# EAGLE design ottSchematic (EAGLE 9.6.2)

## Sheet 1 of 2
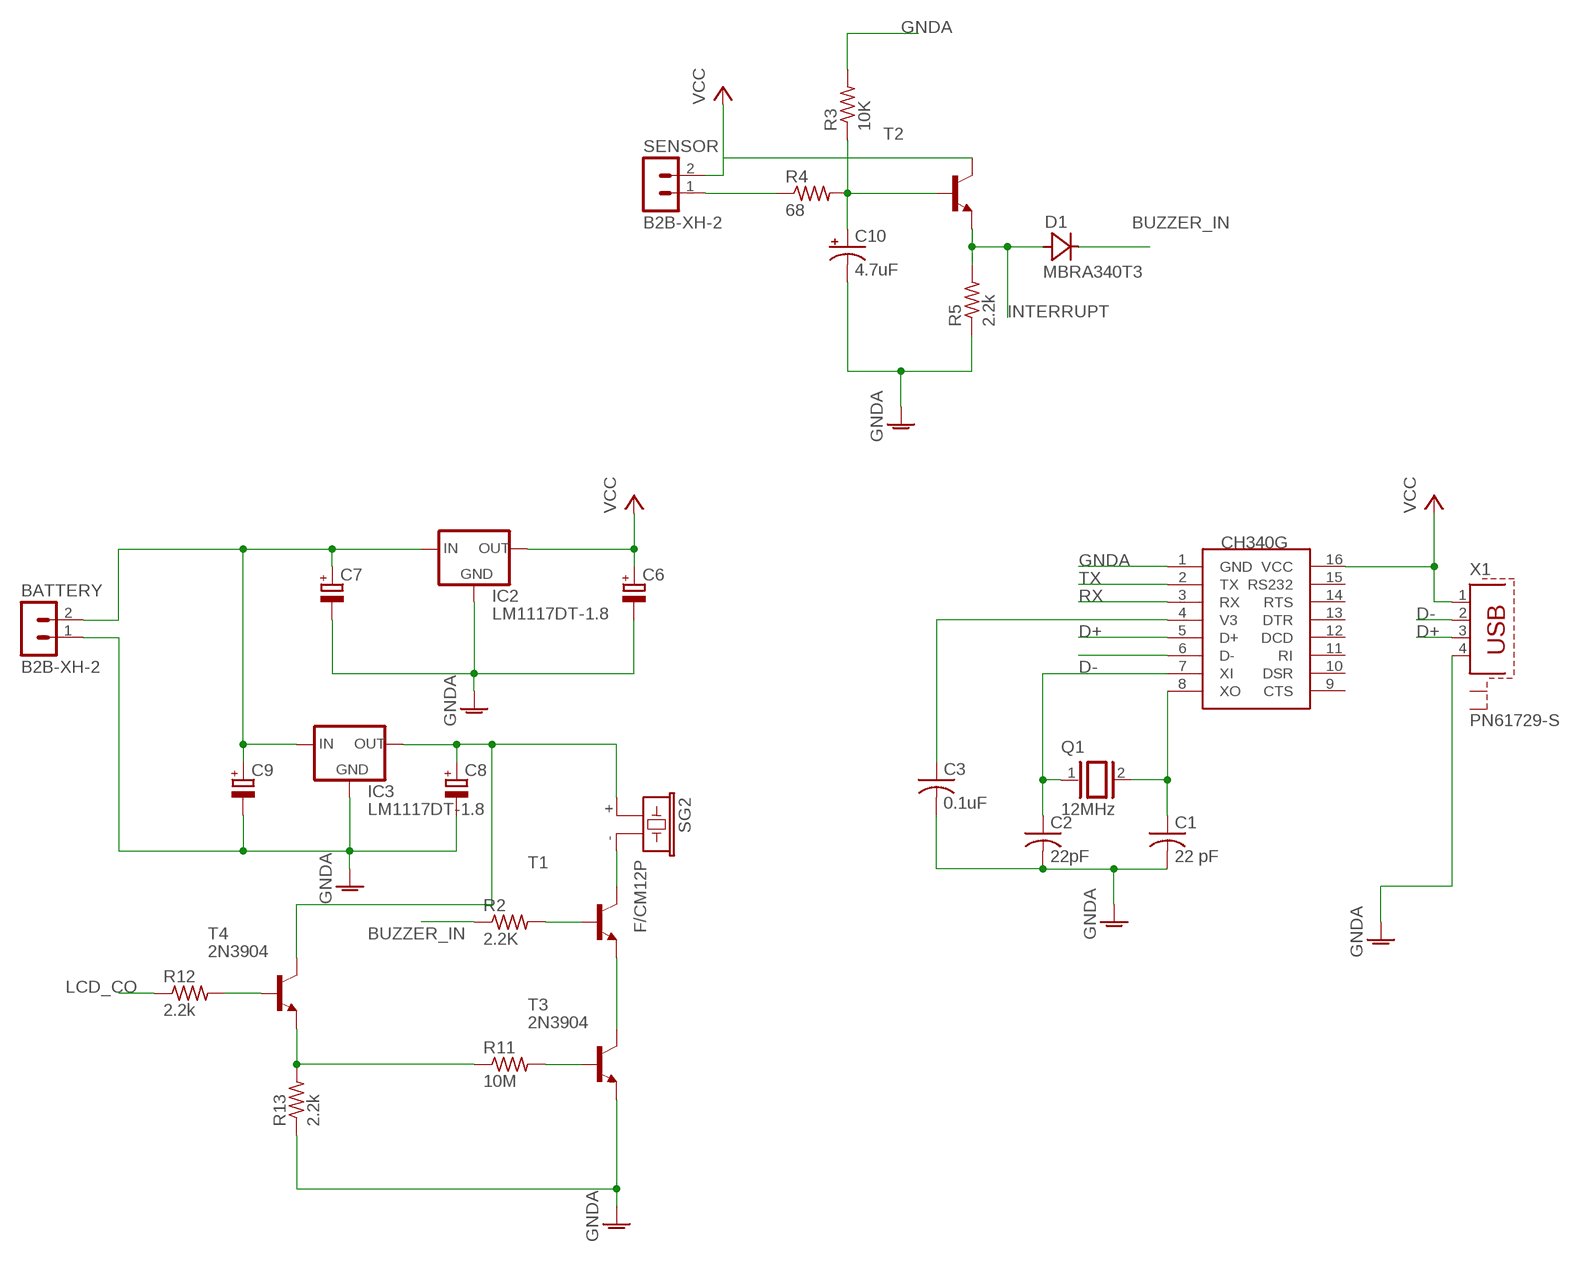
[diagram p0: schematic, sheet 1]

### Parts
BATTERY  B2B-XH-2  [B2B-XH-A]
C1  22 pF  C-USC0603K  [C0603K]
C2  22pF  C-USC0603K  [C0603K]
C3  0.1uF  C-USC1206K  [C1206K]
C6  CPOL-EU175TMP-0808  [175TMP-0808]
C7  CPOL-EU175TMP-0808  [175TMP-0808]
C8  CPOL-EU175TMP-0808  [175TMP-0808]
C9  CPOL-EU175TMP-0808  [175TMP-0808]
C10  4.7uF  CPOL-USE5-8.5  [E5-8,5]
D1  MBRA340T3  [SMA]
IC2  LM1117DT-1.8  [TO252]
IC3  LM1117DT-1.8  [TO252]
Q1  12MHz  XTAL/S  [QS]
R2  2.2K  R-US_R0805  [R0805]
R3  10K  R-US_R0805  [R0805]
R4  68  R-US_0309/12  [0309/12]
R5  2.2k  R-US_R0805  [R0805]
R11  10M  R-US_R0805  [R0805]
R12  2.2k  R-US_R0805  [R0805]
R13  2.2k  R-US_R0805  [R0805]
SENSOR  B2B-XH-2  [B2B-XH-A]
SG2  F/CM12P  [F/CM12P]
T1  MMBT3904LT1-NPN-SOT23-BEC  [SOT23-BEC]
T2  MMBT3904LT1-NPN-SOT23-BEC  [SOT23-BEC]
T3  2N3904  [TO92]
T4  2N3904  [TO92]
U$1  CH340G  [SOIC16]
X1  PN61729-S  [PN61729-S]

### Nets
BUZZER_IN: D1.C R2.1 ; also sheet 2
D+: U$1.5(D+) X1.3
D-: U$1.6(D-) X1.2
GNDA: BATTERY.1 C1.2 C2.2 C3.2 C6.- C7.- C8.- C9.- C10.- IC2.1(GND) IC3.1(GND) R3.2 R5.1 R13.1 T3.3(E) U$1.1(GND) X1.4 ; also sheet 2
INTERRUPT: D1.A R5.2 T2.E ; also sheet 2
LCD_CO: R12.1 ; also sheet 2
N$1: C1.1 Q1.2 U$1.8(XO)
N$2: C2.1 Q1.1 U$1.7(XI)
N$3: C3.1 U$1.4(V3)
N$7: SG2.- T1.C
N$8: C10.+ R3.1 R4.2 T2.B
N$9: BATTERY.2 C7.+ C9.+ IC2.2(IN) IC3.2(IN)
N$10: C8.+ IC3.3(OUT) SG2.+ T4.1(C)
N$12: R4.1 SENSOR.1
N$13: T1.E T3.1(C)
N$14: R2.2 T1.B
N$15: R11.2 T3.2(B)
N$16: R11.1 R13.2 T4.3(E)
N$19: R12.2 T4.2(B)
RX: U$1.3(RX) ; also sheet 2
TX: U$1.2(TX) ; also sheet 2
VCC: C6.+ IC2.3(OUT) SENSOR.2 T2.C U$1.16(VCC) X1.1 ; also sheet 2
Unconnected: U$1.9(CTS) U$1.10(DSR) U$1.11(RI) U$1.12(DCD) U$1.13(DTR) U$1.14(RTS) U$1.15(RS232) X1.S1 X1.S2

## Sheet 2 of 2
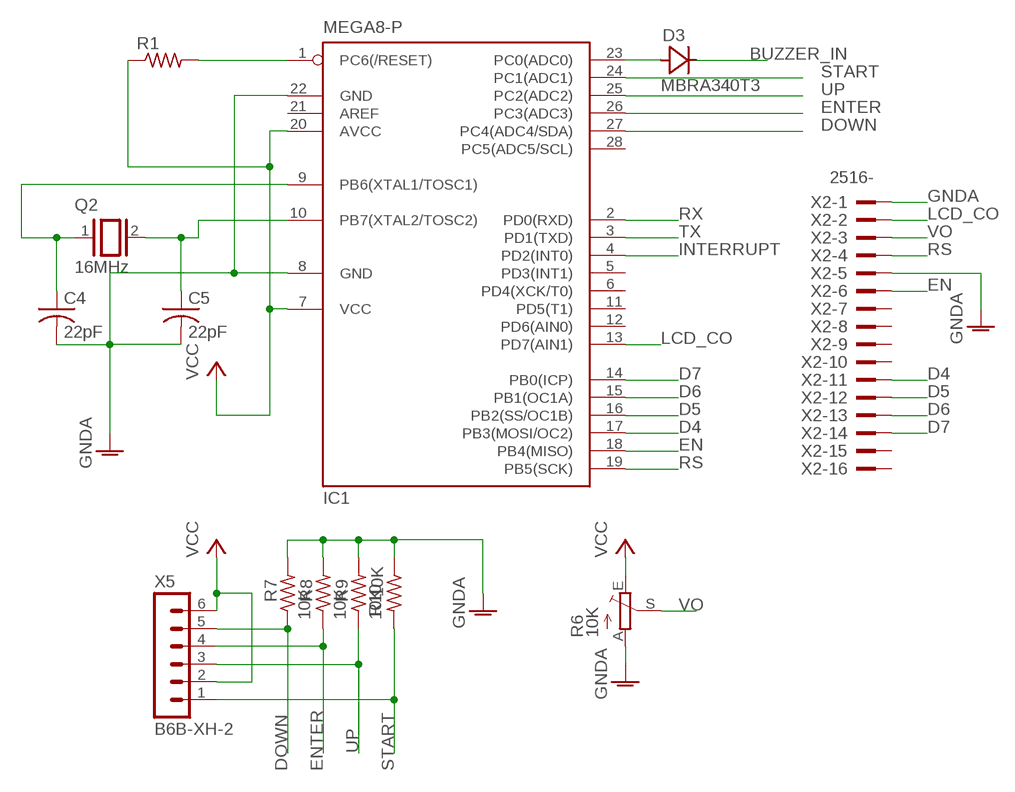
[diagram p1: schematic, sheet 2]

### Parts
C4  22pF  C-USC0805  [C0805]
C5  22pF  C-USC0805  [C0805]
D3  MBRA340T3  [SMA]
IC1  MEGA8-P  [DIL28-3]
Q2  16MHz  XTAL/S  [QS]
R1  R-US_R0805  [R0805]
R6  10K  TRIM_EU-B64Y  [B64Y]
R7  10K  R-US_R0805  [R0805]
R8  10K  R-US_R0805  [R0805]
R9  10K  R-US_R0805  [R0805]
R10  10K  R-US_R0805  [R0805]
X2  2516-  [PAK100/2500-16]
X5  B6B-XH-2  [B6B-XH-A]

### Nets
BUZZER_IN: D3.C ; also sheet 1
D4: IC1.17(PB3(MOSI/OC2)) X2.11
D5: IC1.16(PB2(SS/OC1B)) X2.12
D6: IC1.15(PB1(OC1A)) X2.13
D7: IC1.14(PB0(ICP)) X2.14
DOWN: IC1.27(PC4(ADC4/SDA)) R7.1 X5.5
EN: IC1.18(PB4(MISO)) X2.6
ENTER: IC1.26(PC3(ADC3)) R8.1 X5.4
GNDA: C4.2 C5.2 IC1.8(GND) IC1.22(GND) R6.A R7.2 R8.2 R9.2 R10.1 X2.1 X2.5 ; also sheet 1
INTERRUPT: IC1.4(PD2(INT0)) ; also sheet 1
LCD_CO: IC1.13(PD7(AIN1)) X2.2 ; also sheet 1
N$4: C4.1 IC1.9(PB6(XTAL1/TOSC1)) Q2.1
N$5: C5.1 IC1.10(PB7(XTAL2/TOSC2)) Q2.2
N$6: IC1.1(PC6(/RESET)) R1.2
N$11: D3.A IC1.23(PC0(ADC0))
RS: IC1.19(PB5(SCK)) X2.4
RX: IC1.2(PD0(RXD)) ; also sheet 1
START: IC1.24(PC1(ADC1)) R10.2 X5.1
TX: IC1.3(PD1(TXD)) ; also sheet 1
UP: IC1.25(PC2(ADC2)) R9.1 X5.3
VCC: IC1.7(VCC) IC1.20(AVCC) R1.1 R6.E X5.2 X5.6 ; also sheet 1
VO: R6.S X2.3
Unconnected: IC1.5(PD3(INT1)) IC1.6(PD4(XCK/T0)) IC1.11(PD5(T1)) IC1.12(PD6(AIN0)) IC1.21(AREF) IC1.28(PC5(ADC5/SCL)) X2.7 X2.8 X2.9 X2.10 X2.15 X2.16

## Library data of the parts
BATTERY SENSOR = con-JST XH:B2B-XH: JST XH series header 2.50mm pitch disconnectable crimp style connectors, vertical (side entry type), 2 pins
C1-C5 = rcl:C-US: CAPACITOR, American symbol; SPICEPREFIX: C
C6-C9 = rcl:CPOL-EU: POLARIZED CAPACITOR, European symbol; SPICEPREFIX: C
C10 = rcl:CPOL-US: POLARIZED CAPACITOR, American symbol; SPICEPREFIX: C
D1 D3 = diode:MBRA340T3: Surface Mount Schottky Power Rectifier Source: http://www.onsemi.com/pub_link/Collateral/MBRA340T3-D.PDF
IC1 = atmel:MEGA8-P: MICROCONTROLLER 8 Kbytes FLASH, 1 kbytes SRAM, 512 bytes EEPROM, USART, 4-channel 10 bit ADC, 2-channel 8 bit ADC Pin compatible with Atmega48, ATMega88, ATMega168 Source: avr.lbr; OC_FARNELL: unknown; OC_NEWARK: unknown
IC2 IC3 = lm1117_10:LM1117?-*: 800mA Low-Dropout Linear Regulator Source: http://www.ti.com/lit/ds/symlink/lm1117-n.pdf; MF: Texas Instruments; MPN: LM1117DT-1.8; OC_FARNELL: 1798351; OC_NEWARK: 73R9726
Q1 Q2 = special:XTAL/S: CRYSTAL
R1-R5 R7-R13 = rcl:R-US_: RESISTOR, American symbol; SPICEPREFIX: R
R6 = pot:TRIM_EU-: POTENTIOMETER
SG2 = buzzer:F/CM12P: BUZZER Source: Buerklin; OC_FARNELL: unknown; OC_NEWARK: unknown
T1 T2 = transistor:*-NPN-: NPN Transistror BF959 corrected 2008.03.06
T3 T4 = transistor:2N3904: NPN TRANSISTOR
U$1 = ch340g:CH340G
X1 = con-berg:PN61729-S: BERG USB connector; OC_FARNELL: unknown; OC_NEWARK: unknown
X2 = con-3m:2516-: 3M (TM) Pak 100 4-Wall Header Source: 3M; OC_FARNELL: unknown; OC_NEWARK: unknown
X5 = con-JST XH:B6B-XH: JST XH series header 2.50mm pitch disconnectable crimp style connectors, vertical (side entry type), 6 pins

## Board
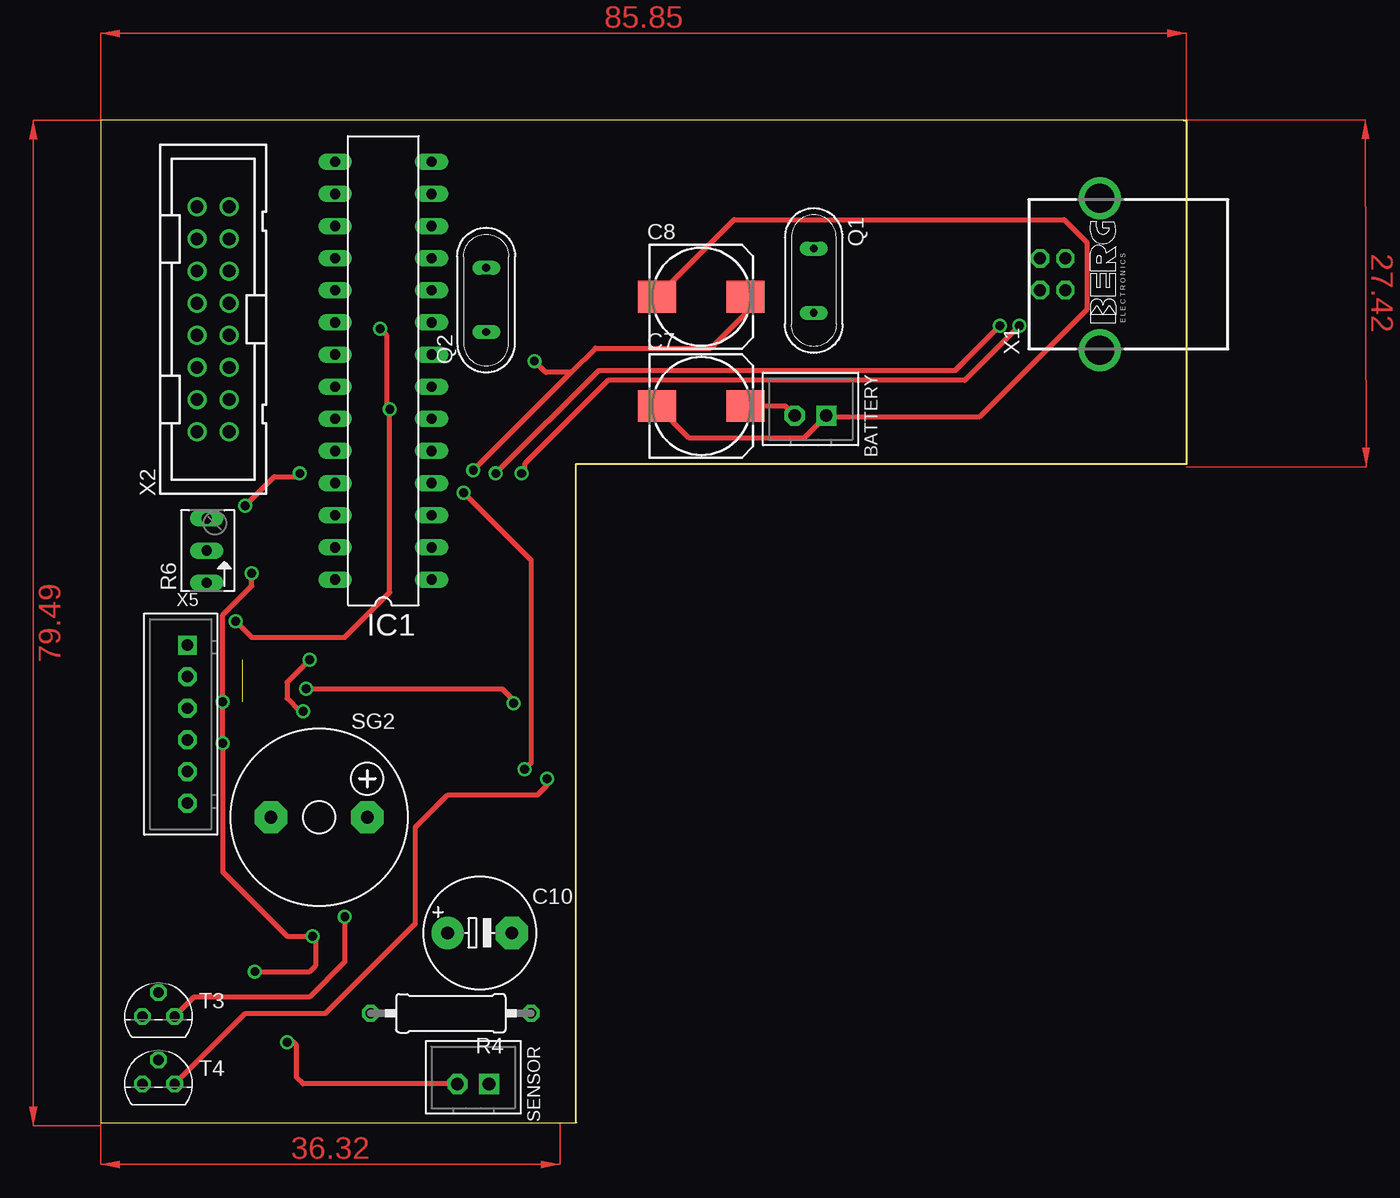
[diagram p2: board, top side]
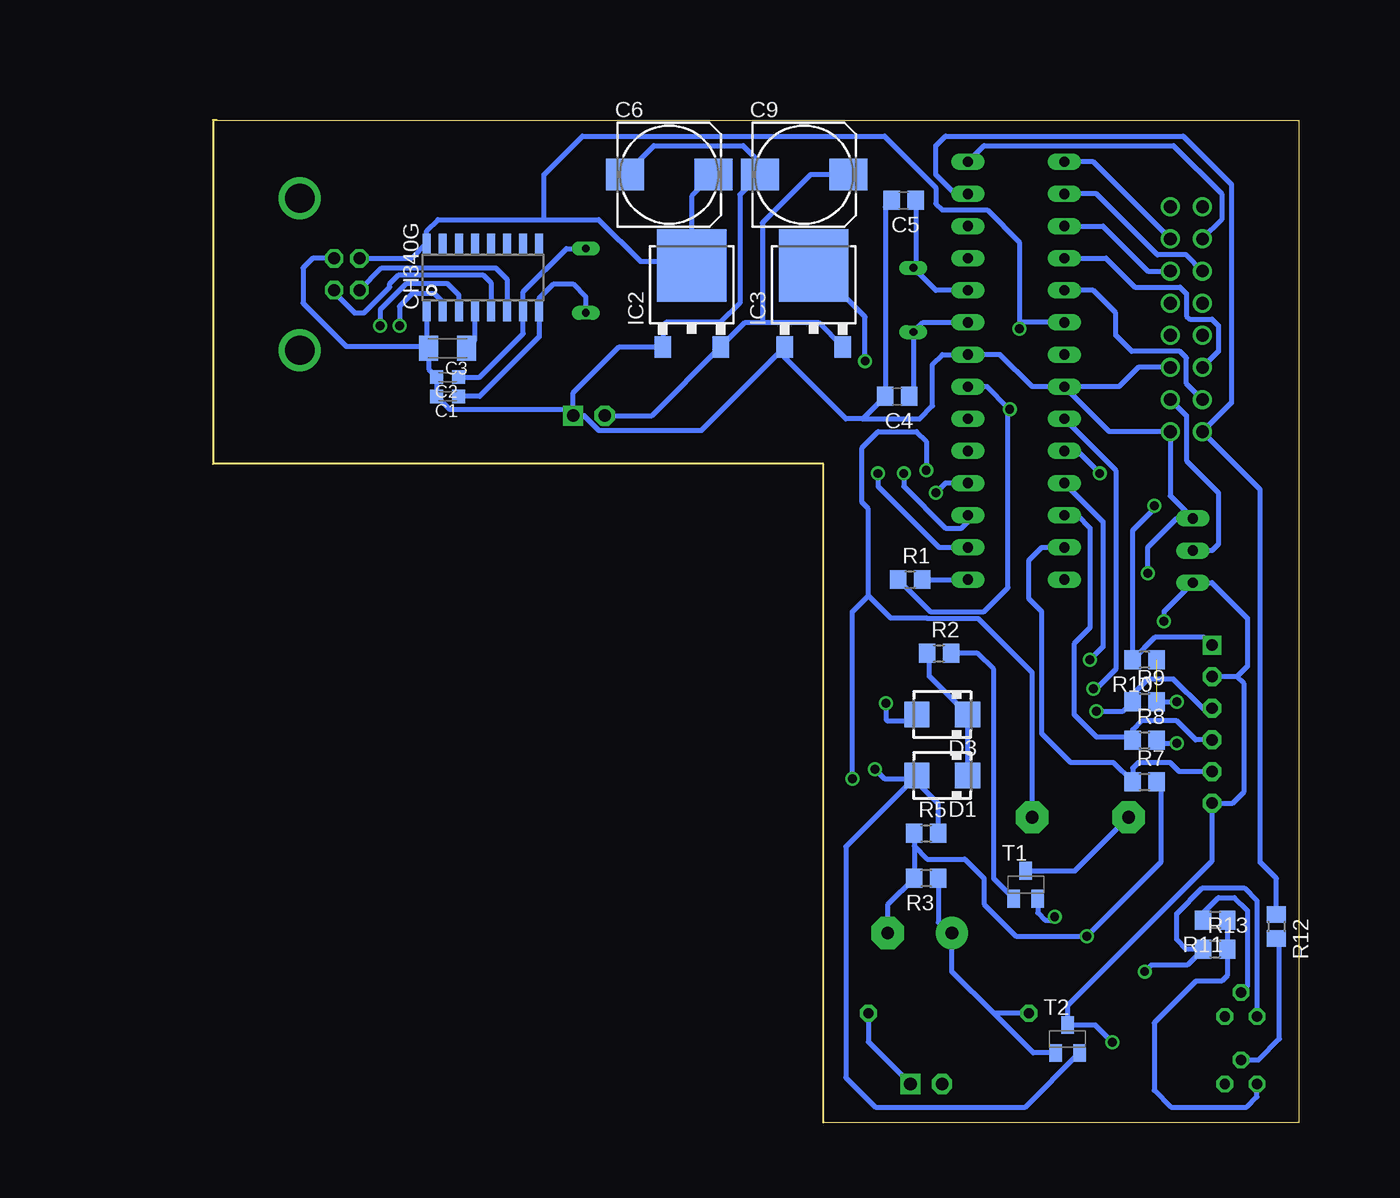
[diagram p3: board, bottom side, seen from below]

Size 85.85 x 79.25 mm. Coordinates in mm from the lower left corner, seen from the top.
Outline: 85.78,79.24 0,79.24 0,0 37.59,0 37.59,52.07 85.85,52.07 85.85,79.25 85.6,79.25
Copper layers (1*16): Top 0.035mm / dielectric 1.5mm / Bottom 0.035mm
Design rules "default": minimum track width 6mil, minimum drill 0.35mm, track to track 6mil, track to pad 6mil, pad to pad 6mil, via to via 6mil, smd to smd 6mil, copper to edge 40mil, drill to drill 6mil, minimum pad ring 10mil, minimum via ring 8mil, stop-mask expansion 4mil, vias tented up to drill 0mil, thermal gap 10mil

### Footprints (pad centres in the part's own frame; a part is rotated, then mirrored left to right if it is on the bottom)
B2B-XH-A = drill 1 pad 1.6 square: 1 1.25,0 | drill 1 pad 1.6 octagon: 2 -1.25,0
C0603K = smd 1.05 x 1.08: 1 -0.875,0; 2 0.875,0
C1206K = smd 1.5 x 2: 1 -1.5,0; 2 1.5,0
C0805 = smd 1.3 x 1.5: 1 -0.95,0; 2 0.95,0
175TMP-0808 = smd 3 x 2.5: + 3.5,0; - -3.5,0
E5-8,5 = drill 1.016 pad 2.54: + -2.54,0 | drill 1.016 pad 2.54 octagon: - 2.54,0
SMA = smd 2 x 2: A 2,0; C -2,0
DIL28-3 = drill 0.813 long: 1 -16.51,-3.81; 2 -13.97,-3.81; 3 -11.43,-3.81; 4 -8.89,-3.81; 5 -6.35,-3.81; 6 -3.81,-3.81; 7 -1.27,-3.81; 8 1.27,-3.81; 9 3.81,-3.81; 10 6.35,-3.81; 11 8.89,-3.81; 12 11.43,-3.81; 13 13.97,-3.81; 14 16.51,-3.81; 15 16.51,3.81; 16 13.97,3.81; 17 11.43,3.81; 18 8.89,3.81; 19 6.35,3.81; 20 3.81,3.81; 21 1.27,3.81; 22 -1.27,3.81; 23 -3.81,3.81; 24 -6.35,3.81; 25 -8.89,3.81; 26 -11.43,3.81; 27 -13.97,3.81; 28 -16.51,3.81
TO252 = smd 1.3 x 1.7: 1 -2.285,-4.22; 2 2.285,-4.22 | smd 5.5 x 5.7: 3 0,2.22
QS = drill 0.61 long: 1 -2.54,0; 2 2.54,0
R0805 = smd 1.3 x 1.5: 1 -0.95,0; 2 0.95,0
0309/12 = drill 0.813 octagon: 1 -6.35,0; 2 6.35,0
B64Y = drill 0.813 long: A 2.54,0; E -2.54,0; S 0,0
F/CM12P = drill 1.016 pad 2.54 octagon: + 3.81,0; - -3.81,0
SOT23-BEC = smd 1 x 1.4: B -0.95,-1.1; C 0,1.1; E 0.95,-1.1
TO92 = drill 0.813 octagon: 1 1.27,0; 2 0,1.905; 3 -1.27,0
SOIC16 = smd 0.635 x 1.524: 1 -4.445,-2.695; 2 -3.175,-2.695; 3 -1.905,-2.695; 4 -0.635,-2.695; 5 0.635,-2.695; 6 1.905,-2.695; 7 3.175,-2.695; 8 4.445,-2.695; 9 4.445,2.695; 10 3.175,2.695; 11 1.905,2.695; 12 0.635,2.695; 13 -0.635,2.695; 14 -1.905,2.695; 15 -3.175,2.695; 16 -4.445,2.695
PN61729-S = drill 0.95 octagon: 1 1.25,4.71; 2 -1.25,4.71; 3 -1.25,2.71; 4 1.25,2.71 | drill 2.3 pad 2.9: S1 -6.02,0; S2 6.02,0
PAK100/2500-16 = drill 1 pad 1.422: 1 -8.89,-1.27; 2 -8.89,1.27; 3 -6.35,-1.27; 4 -6.35,1.27; 5 -3.81,-1.27; 6 -3.81,1.27; 7 -1.27,-1.27; 8 -1.27,1.27; 9 1.27,-1.27; 10 1.27,1.27; 11 3.81,-1.27; 12 3.81,1.27; 13 6.35,-1.27; 14 6.35,1.27; 15 8.89,-1.27; 16 8.89,1.27
B6B-XH-A = drill 0.9 pad 1.5 square: 1 6.25,0 | drill 0.9 pad 1.5 octagon: 2 3.75,0; 3 1.25,0; 4 -1.25,0; 5 -3.75,0; 6 -6.25,0

### Placement (x,y rotation side)
BATTERY  56.13,55.88 0 top
C1  67.31,57.4 180 bottom
C2  67.31,58.93 180 bottom
C3  67.31,61.21 180 bottom
C4  31.75,57.4 180 bottom
C5  31.24,72.9 180 bottom
C6  49.78,74.93 0 bottom
C7  47.5,56.64 0 top
C8  47.5,65.28 0 top
C9  39.12,74.93 0 bottom
C10  29.97,14.99 0 top
D1  28.19,27.43 180 bottom
D3  28.19,32.26 180 bottom
IC1  22.35,59.44 90 top
IC2  48.01,65.53 0 bottom
IC3  38.35,65.53 0 bottom
Q1  56.39,66.55 270 top
Q2  30.48,65.02 90 top
R1  30.73,42.93 0 bottom
R2  28.45,37.08 0 bottom
R3  29.46,19.3 180 bottom
R4  27.69,8.64 180 top
R5  29.46,22.86 0 bottom
R6  8.38,45.21 90 top
R7  12.19,26.92 0 bottom
R8  12.19,30.23 0 bottom
R9  12.19,33.27 0 bottom
R10  12.19,36.58 180 bottom
R11  6.6,16 180 bottom
R12  1.78,15.49 270 bottom
R13  6.6,13.72 0 bottom
SENSOR  29.46,3.05 0 top
SG2  17.27,24.13 0 top
T1  21.59,18.8 0 bottom
T2  18.29,6.6 0 bottom
T3  4.57,8.38 0 top
T4  4.57,3.05 0 top
U$1  64.52,66.8 0 bottom
X1  78.99,67.06 90 top
X2  8.89,63.5 90 top
X5  6.86,31.5 90 top

### Tracks (layer width: path | path; a pad name or v marks a point on that pad's centre or on a via)
BUZZER_IN
  Bottom 0.406: D1.C D3.C 29.21,35.27 29.21,36.9 R2.1
D4
  Bottom 0.406: IC1.17 15.49,70.87 11.94,67.31 X2.11
D5
  Bottom 0.406: X2.12 8.89,68.58 11.18,68.58 16,73.41 IC1.16
D6
  Bottom 0.406: X2.13 16.26,75.95 IC1.15
D7
  Bottom 0.406: IC1.14 24.89,77.22 9.91,77.22 6.1,73.41 6.1,71.37 X2.14
D+
  Bottom 0.406: X1.3 76.28,65.62 74.68,64.01 73.91,64.01 71.88,66.04 71.88,66.29 71.17,67 64.52,67 63.88,66.37 U$1.5
D-
  Bottom 0.406: X1.2 72.53,67.56 63.5,67.56 62.61,66.67 U$1.6
DOWN
  Bottom 0.406: 6.92,27.69 X5.5 9.46,27.75 10.16,28.45 12.7,28.45 13.14,28.01 R7.1 14.67,28.45 18.03,28.45 20.32,30.73 20.32,40.39 21.34,41.4 21.34,44.45 20.32,45.47 IC1.27
EN
  Bottom 0.406: IC1.18 15.24,68.33 12.95,66.04 9.4,66.04 8.89,65.53 8.89,63.75 8.64,63.5 6.86,63.5 6.35,62.99 6.35,60.96 X2.6
ENTER
  Bottom 0.406: 6.88,30.23 X5.4 8.15,30.25 9.65,31.75 12.45,31.75 13.14,31.05 13.14,30.48 | 13.14,30.48 R8.1 | IC1.26 17.53,48.01 16.51,46.99 16.51,39.12 17.78,37.85 17.78,32.26 16,30.48 13.14,30.48
GNDA  (via drill 0.7)  (1 unrouted)
  Top 0.406: BATTERY.1 57.27,55.76 | 57.27,55.76 55.61,54.1 46.54,54.1 C7.- | C8.- 50.09,71.37 76.2,71.37 77.98,69.6 77.98,64.26 69.48,55.76 57.27,55.76 | v11.94,43.43 11.94,42.42 9.65,40.13 v9.65,33.27 v9.65,29.97 9.65,19.81 14.73,14.73 v16.76,14.73 17.02,14.48 17.02,12.45 16.51,11.94 v12.19,11.94
  Bottom 0.406: U$1.1 68.96,61.37 | 68.96,61.37 C3.2 68.81,59.55 C2.2 C1.2 67.17,56.39 57.89,56.39 BATTERY.1 | X1.4 78,68.31 78.74,67.56 78.74,64.77 75.33,61.37 68.96,61.37 | BATTERY.1 57.38,57.68 53.75,61.31 IC2.1 50.29,62.99 50.04,63.25 45.72,63.25 44.2,64.77 44.2,73.35 C9.- 42.62,75.89 43.94,77.22 51,77.22 C6.- | BATTERY.1 56.52,55.88 55.36,54.72 47.23,54.72 IC3.1 40.64,60.45 35.81,55.63 34.48,55.63 | 30.34,19.38 R3.2 | 34.48,55.63 29.97,55.63 28.96,56.64 28.96,59.94 28.19,60.71 IC1.8 23.62,60.71 21.08,58.17 IC1.22 | 34.48,55.63 C4.2 32.7,72.39 C5.2 | X2.5 12.7,59.69 14.22,58.17 IC1.22 | IC1.22 14.99,54.61 X2.1 10.16,49.53 R6.A 9.65,47.75 11.94,45.47 v11.94,43.43 | R3.2 32.51,17.21 C10.- | R5.1 30.41,21.84 | 30.41,21.84 R3.2 | 30.41,21.84 29.4,20.83 26.42,20.83 24.89,19.3 24.89,17.27 22.35,14.73 v16.76,14.73 10.92,20.57 10.92,26.6 R7.2 | R8.2 10.99,29.97 v9.65,29.97 | R9.2 v9.65,33.27 | T3.3 3.3,17.53 4.32,18.54 7.62,18.54 9.65,16.51 9.65,14.48 8.89,13.72 R13.1 8.82,12.45 11.68,12.45 v12.19,11.94
INTERRUPT  (via drill 0.7)
  Top 0.406: v28.7,49.78 34.04,44.45 34.04,28.45 v33.53,27.94
  Bottom 0.406: R5.2 28.51,25.21 30.48,27.18 | 30.48,27.18 30.23,27.43 D1.A 35.81,21.81 35.81,3.56 33.48,1.22 21.62,1.22 T2.E | IC1.4 27.94,50.55 v28.7,49.78 | v33.53,27.94 32.77,27.18 30.48,27.18
LCD_CO
  Bottom 0.406: IC1.13 27.18,73.41 28.7,74.93 28.7,77.22 27.94,77.98 9.14,77.98 5.33,74.17 5.33,56.9 X2.2 3.05,50.04 3.05,20.57 1.78,19.3 R12.1
N$1
  Bottom 0.406: C1.1 64.77,57.4 60.07,62.1 U$1.8 60.07,65.15 58.93,66.29 57.4,66.29 56.39,65.28 Q1.2
N$2
  Bottom 0.406: C2.1 64.77,58.93 61.34,62.36 U$1.7 61.34,65.66 57.91,69.09 Q1.1
N$3
  Bottom 0.406: C3.1 65.15,61.87 U$1.4
N$4
  Bottom 0.406: IC1.9 29.72,63.25 Q2.1 30.48,57.72 C4.1
N$5
  Bottom 0.406: IC1.10 28.7,65.79 Q2.2 30.29,67.75 C5.1
N$6
  Bottom 0.406: R1.2 IC1.1
N$7
  Bottom 0.406: T1.C 17.7,19.9 SG2.-
N$8
  Bottom 0.406: R4.2 24.13,8.64 | 27.43,14.73 27.43,11.94 24.13,8.64 | 27.43,14.73 C10.+ | R3.1 28.51,15.81 27.43,14.73 | T2.B 21,5.5 24.13,8.64
N$9
  Top 0.406: C7.+ 54.12,56.64 BATTERY.2
  Bottom 0.406: BATTERY.2 51.15,55.88 IC2.2 43.79,63.25 42.42,63.25 | IC3.2 38,63.25 42.42,63.25 | C9.+ 38.61,74.93 42.42,71.12 42.42,63.25
N$10  (via drill 0.7)
  Top 0.406: v29.46,51.56 37.21,59.31 | 37.21,59.31 39.12,61.21 48.26,61.21 51.31,64.26 51.31,64.97 C8.+ | 37.21,59.31 35.18,59.31 v34.29,60.2 | T4.1 11.43,8.64 17.78,8.64 24.89,15.75 24.89,23.37 27.43,25.91 34.54,25.91 35.31,26.67 v35.31,27.18
  Bottom 0.406: SG2.+ 21.08,35.56 25.35,39.83 29.38,39.83 29.43,39.88 32.26,39.88 34.04,41.66 | v29.46,51.56 29.46,53.85 30.23,54.61 33.27,54.61 34.54,53.34 34.54,49.02 34.04,48.51 34.04,41.66 | v34.29,60.2 34.29,63.69 IC3.3 | v35.31,27.18 35.31,40.39 34.04,41.66
N$11  (via drill 0.7)
  Top 0.406: v16.26,34.29 31.75,34.29 32.77,33.27 v32.64,33.15
  Bottom 0.406: IC1.23 14.48,51.56 14.48,35.81 16,34.29 v16.26,34.29 | v32.64,33.15 32.64,31.88 32.51,31.75 30.7,31.75 D3.A
N$12
  Bottom 0.406: R4.1 34.04,6.37 SENSOR.1
N$13  (via drill 0.7)
  Top 0.406: v19.3,16.26 19.3,12.7 16.51,9.91 7.37,9.91 T3.1
  Bottom 0.406: T1.E 20.64,16.58 20.07,16 19.3,16 v19.3,16.26
N$14
  Bottom 0.406: T1.B 24.13,19.29 24.13,35.81 25.4,37.08 R2.2
N$15
  Bottom 0.406: R11.2 7.55,16.58 6.35,17.78 5.08,17.78 4.06,16.76 4.06,10.79 T3.2
N$16
  Bottom 0.406: R11.1 R13.2 5.65,11.62 6.1,11.18 8.13,11.18 11.43,7.87 11.43,2.54 10.11,1.22 4.12,1.22 3.3,2.03 T4.3
N$19
  Bottom 0.406: T4.2 3.17,4.95 1.52,6.6 1.52,14.29 R12.2
RS
  Bottom 0.406: X2.4 8.89,58.42 8.89,60.45 9.4,60.96 13.21,60.96 14.48,62.23 14.48,64.01 16.26,65.79 IC1.19
RX  (via drill 0.7)
  Top 0.406: v72.64,62.99 68.33,58.67 40.13,58.67 33.53,52.07 33.53,51.56 v33.27,51.31
  Bottom 0.406: U$1.3 66.42,65.41 67.31,66.29 70.61,66.29 72.64,64.26 v72.64,62.99 | v33.27,51.31 33.27,50.29 28.45,45.47 IC1.2
START  (via drill 0.7)
  Top 0.406: v11.43,48.77 13.72,51.05 15.75,51.05 v15.75,51.31
  Bottom 0.406: X5.1 7.47,38.35 11.37,38.35 12.25,37.47 R10.2 13.14,46.8 11.43,48.51 v11.43,48.77 | v15.75,51.31 17.53,53.09 IC1.24
TX  (via drill 0.7)
  Top 0.406: v71.12,62.99 67.56,59.44 39.37,59.44 v31.24,51.31
  Bottom 0.406: U$1.2 67.69,64.9 68.33,65.53 70.1,65.53 71.12,64.52 v71.12,62.99 | v31.24,51.31 31.24,50.29 27.94,46.99 26.67,46.99 26.16,47.5 IC1.3
UP  (via drill 0.7)
  Top 0.406: v16.51,36.58 14.73,34.8 14.73,33.53 15.75,32.51 v16,32.51
  Bottom 0.406: 6.88,32.77 X5.3 7.6,32.75 9.91,35.05 11.94,35.05 13.14,33.85 R9.1 13.9,32.51 v16,32.51 | IC1.25 15.49,47.5 15.49,37.59 v16.51,36.58
VCC  (via drill 0.7)
  Top 0.406: v22.1,62.74 22.61,62.23 22.61,56.64 v22.86,56.39 22.86,41.91 19.3,38.35 11.94,38.35 v10.67,39.62 | SENSOR.2 16,3.05 15.49,3.56 15.49,6.1 15.24,6.35 v14.73,6.35
  Bottom 0.406: X1.1 74.26,68.33 70.13,68.33 U$1.16 68.96,70.48 68.07,71.37 59.69,71.37 | 59.69,71.37 55.37,71.37 52.07,68.07 48.33,68.07 IC2.3 48.01,73.21 C6.+ | 4.89,35.25 X5.2 | 4.89,35.25 4.06,36.07 4.06,39.88 6.86,42.67 R6.E 10.67,40.39 v10.67,39.62 | 4.89,35.25 4.32,34.68 4.32,26.16 5.23,25.25 X5.6 6.86,20.66 18.29,9.23 T2.C 16.09,7.7 v14.73,6.35 | IC1.20 21.84,63.25 22.1,62.99 v22.1,62.74 22.1,69.6 24.64,72.14 28.19,72.14 28.7,72.64 28.7,73.91 32.77,77.98 56.64,77.98 59.69,74.93 59.69,71.37 | v22.86,56.39 22.99,56.52 | 22.99,56.52 24.64,58.17 IC1.7 | R1.1 30.79,42.03 29.15,40.39 24.89,40.39 22.99,42.29 22.99,56.52
VO
  Bottom 0.406: X2.3 8.89,55.88 8.89,52.32 6.35,49.78 6.35,45.72 6.86,45.21 R6.S
(copper drawn outside any net)
  shapes: Top area x4